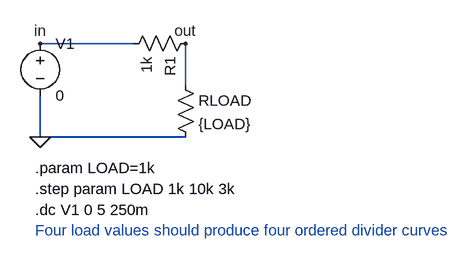
[diagram p0: schematic 05_step_loaded_divider.asc]
05_step_loaded_divider.asc, the LTspice schematic file:
Version 4
SHEET 1 880 680
WIRE 80 96 224 96
WIRE 304 96 304 160
WIRE 80 176 80 240
WIRE 80 240 304 240
FLAG 80 240 0
FLAG 80 96 in
FLAG 304 96 out
SYMBOL voltage 80 80 R0
SYMATTR InstName V1
SYMATTR Value 0
SYMBOL res 320 80 R90
SYMATTR InstName R1
SYMATTR Value 1k
SYMBOL res 288 144 R0
SYMATTR InstName RLOAD
SYMATTR Value {LOAD}
TEXT 72 288 Left 2 !.param LOAD=1k
TEXT 72 320 Left 2 !.step param LOAD 1k 10k 3k
TEXT 72 352 Left 2 !.dc V1 0 5 250m
TEXT 72 384 Left 2 ;Four load values should produce four ordered divider curves

The netlist it stands for:
* 05_step_loaded_divider.asc
V1 in 0 0
R1 out in 1k
RLOAD out 0 {LOAD}
.param LOAD=1k
.step param LOAD 1k 10k 3k
.dc V1 0 5 250m
* Four load values should produce four ordered divider curves
.backanno
.end